# Altium schematic sheet Transmitter.SchDoc
size A; SheetNumber: 2; SheetTotal: 3
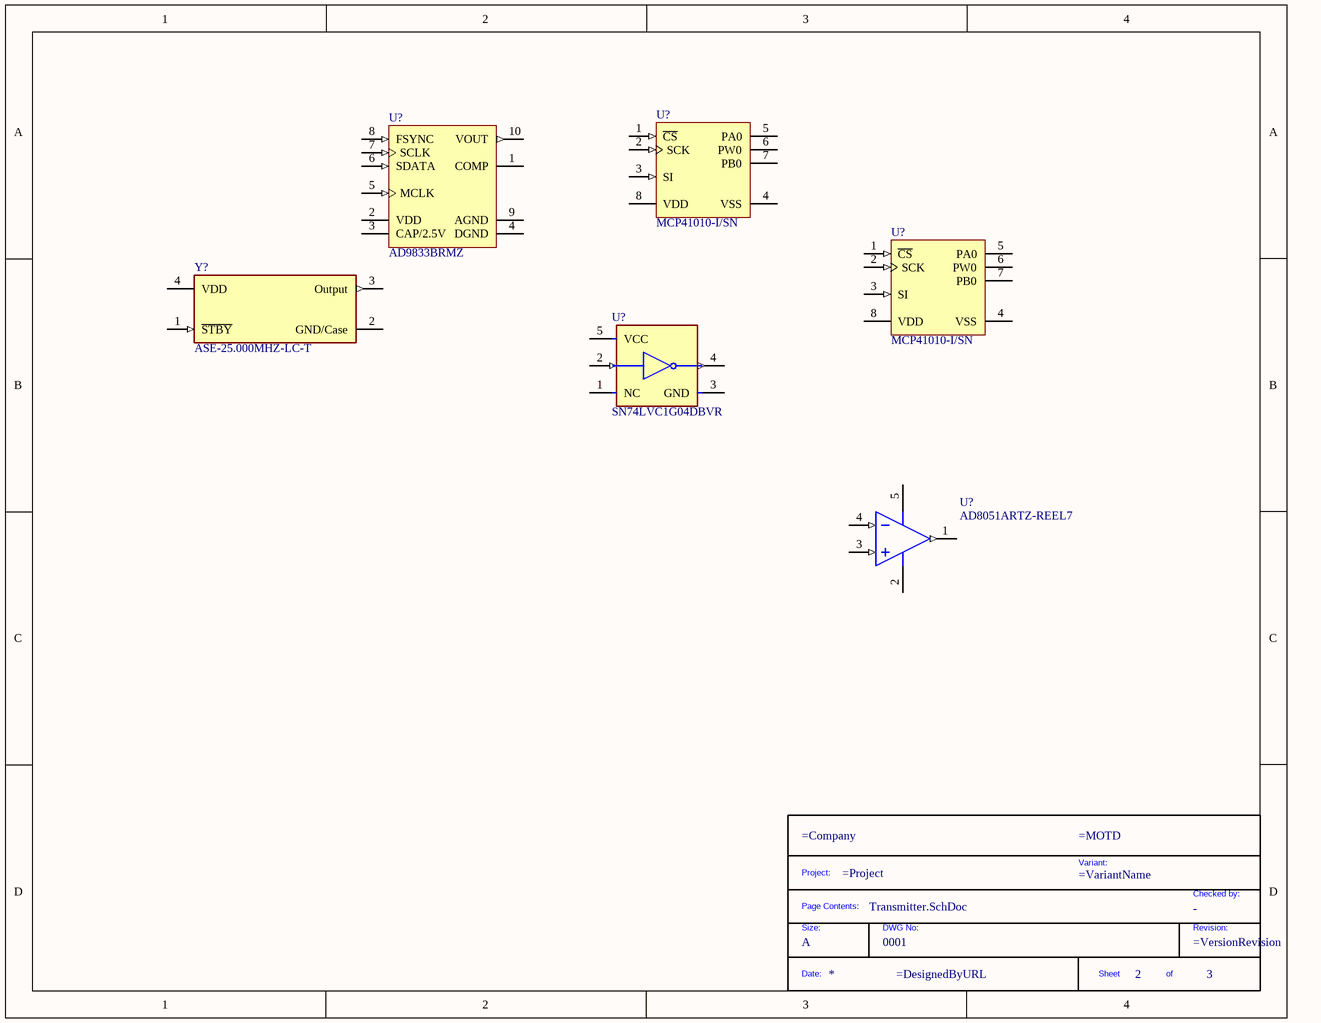
[diagram p0: Transmitter.SchDoc]

## Parts
(Parts that share a designator on the sheet are numbered #1, #2 ... from top to bottom, then left to right.)
*?  DWG No: 0001  Size: A  (hidden comment: TitleBlock)  (graphical)
U?#1  MCP41010-I/SN  [SOIC-SN8_M]
U?#2  AD9833BRMZ  [ADI-RM-10_N]
U?#3  MCP41010-I/SN  [SOIC-SN8_M]
U?#4  SN74LVC1G04DBVR  [FP-DBV0005A-MFG]
U?#5  AD8051ARTZ-REEL7  [ADI-RJ-5_N]
Y?  ASE-25.000MHZ-LC-T  [FP-ASE-MFG]

## Nets

Not connected (* = marked no-connect by the designer): U?#1 1(~{CS}) 2(SCK) 3(SI) 4(VSS) 5(PA0) 6(PW0) 7(PB0) 8(VDD); U?#2 1(COMP) 2(VDD) 3(CAP/2.5V) 4(DGND) 5(MCLK) 6(SDATA) 7(SCLK) 8(FSYNC) 9(AGND) 10(VOUT); U?#3 1(~{CS}) 2(SCK) 3(SI) 4(VSS) 5(PA0) 6(PW0) 7(PB0) 8(VDD); U?#4 1(NC) 2(A) 3(GND) 4(Y) 5(VCC); U?#5 1(VOUT) 2(-VS) 3(+IN) 4(-IN) 5(+VS); Y? 1(~{STBY}) 2(GND/Case) 3(Output) 4(VDD)

## Notes on the sheet
- (in symbol TitleBlock) Project:; Variant:; Checked by:; Page Contents:; Size:; DWG No:; Revision:; Date:; Sheet; of

## Library data of the parts
*? = TitleBlock: Standard Title Block; Checked by: -
U?#1 U?#3 = CMP-0188-00462-2: Single/Dual Digital Potentiometer with SPI Interface, 8-Pin SOIC 150mil, Industrial Temperature; Code_IPC: SOIC127P600-8; ComponentLink3Description: Package Specification; ComponentLink2URL: http://ww1.microchip.com/downloads/en/DeviceDoc/11195c.pdf; PackageReference: SOIC-SN8; ComponentLink2Description: Datasheet; PackageVersion: revBB, Aug-2009; PackageDescription: 8-Lead Plastic Small Outline (SN) - Narrow, 3.90mm Body [SOIC]; DatasheetVersion: Jul-2003; ComponentLink1URL: http://www.microchip.com/; Code_JEDEC: MS-012; ComponentLink3URL: http://www.microchip.com/stellent/groups/techpub_sg/documents/packagingspec/en012702.pdf; ComponentLink1Description: Manufacturer URL; RevisionNote: URLs added.
U?#2 = CMP-0293-00077-1: Low Power, 12.65 mW, 2.3 V to 5.5 V, Programmable Waveform Generator, 10-Bit, Serial, RM-10, 50 Tube, Pb-Free; Resolution (Bits): 10bit; Compliance Range (V): 650mV; FS Iout (mA nom): 3mA; REFCLK Multiplier: No; Master fclk: 25MHz; I Supply total (max): 5.5mA; Tuning Word Width (bits): 28bit; Code_JEDEC: MO-187-BA; DatasheetVersion: Rev. D; PackageVersion: 5/8/2005; ComponentLink1URL: www.analog.com; ComponentLink3Description: Package Specification; PackageDescription: 10-Lead Mini Small Outline Package [MSOP]; I/O Interface: Serial; ComponentLink2Description: Datasheet; ComponentLink1Description: Manufacturer URL; PackageReference: RM-10; ComponentLink2URL: http://www.analog.com/static/imported-files/data_sheets/AD9833.pdf; ComponentLink3URL: http://www.analog.com/static/imported-files/packages/PKG_PDF/MSOP%28RM%29/RM_10.pdf
U?#4 = CMP-0859-00134-4: IC INVERTER 1CH 1-INP SOT23-5; Number of Elements: 1; Turn-On Delay Time: 7.5ns; Propagation Delay: 3.7ns; Max Supply Voltage: 5.5V; Max Output Current: 32mA; Quiescent Current: 10uA; High Level Output Current: -32mA; Schmitt Trigger Input: No; Min Supply Voltage: 1.65V; Number of Circuits: 1; Lead Free: Lead Free; Number of Inputs: 1; Mount: Surface Mount; Length: 3.05mm; Width: 1.75mm; Number of Pins: 5; Case/Package: SOT-23; REACH SVHC: No SVHC; Low Level Output Current: 32mA; Package Quantity: 1; Height: 1.3mm; Radiation Hardening: No; Packaging: Tape and Reel; Output Current: 32mA; Max Operating Temperature: 125°C; Termination: SMD/SMT; Min Operating Temperature: -40°C; Number of Gates: 1; Weight: 0.000557oz; Logic Function: Inverter; Number of Bits: 1; Contact Plating: Tin
U?#5 = CMP-0384-01453-2: Single Channel Single-Supply Operation Operational Amplifier, 110 MHz BW, 170 V/us SR, Industrial, 5-pin SOT23 (RJ-5), Reel; Generic Part Number: AD8051; Manufacturer: Analog Devices; V Span Max: 12V; Input Bias Current: 1.4uA; Iq/Amp: 5.5mA; Input Offset Voltage: 1.7mV; Small Signal Bandwidth: 110MHz; V Span Min: 3V; Amplifiers Per Package: 1; PackageDescription: 5-Pin Small Outline Transistor Package, Body 2.9 x 1.6 mm, Pitch 0.95 mm; PartNumber: AD8051ARTZ-REEL7; ComponentLink2Description: Datasheet; ComponentLink1Description: Manufacturer URL; Mounting Technology: Surface Mount; ComponentLink1URL: http://www.analog.com/en/index.html; PackageVersion: 121608-A; ComponentLink3Description: Package Specification; Code_JEDEC: MO-178-AA; ComponentLink2URL: http://www.analog.com/static/imported-files/data_sheets/AD8051_8052_8054.pdf; PackageReference: RJ-5; RevisionNote: Symbol corrected, Pin 2 orientation reversed; DatasheetVersion: Rev. J; ComponentLink3URL: http://www.analog.com/static/imported-files/packages/PKG_PDF/SOT-23(RJ)/RJ_5.pdf; Slew Rate: 170V/us; Packing: Reel
Y? = CMP-2000-05795-3: XTAL Oscillator 25MHz ±50ppm CMOS 3.3V 4-SMD 3.2mm x 2.5mm; Load Capacitance: 15pF; Min Supply Voltage: 3.135V; Max Supply Voltage: 3.465V; Max Supply Current: 13mA; Max Operating Temperature: 85°C; Termination: SMD/SMT; Operating Frequency: 25 MHz; Height: 0.047inch; Frequency: 25MHz; Mount: Surface Mount; Number of Pins: 4; Length: 3.2mm; Packaging: Tape and Reel; Frequency Stability: 50ppm; Series: ASE; Radiation Hardening: No; Package Quantity: 1000; Width: 2.5mm; Min Operating Temperature: -40°C; Lead Free: Lead Free; Case/Package: SMD/SMT; Depth: 2.5mm; Operating Supply Voltage: 3.3V